# EAGLE design tcxo_breakout (EAGLE 9.2.2)
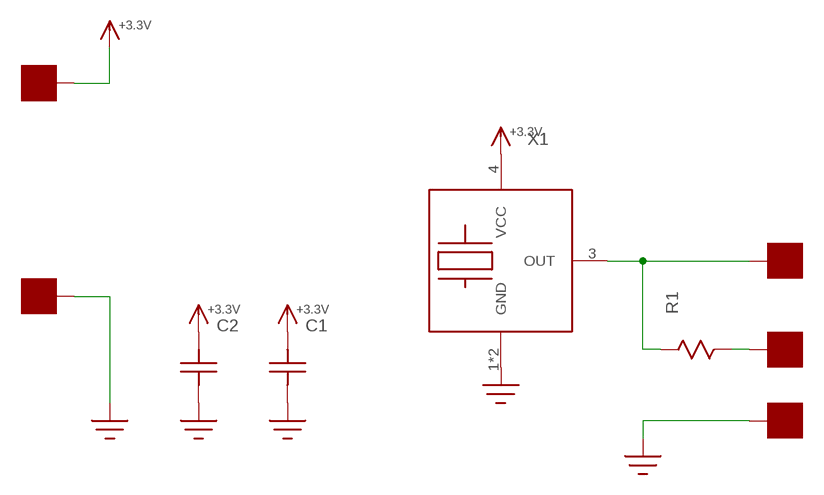
[diagram p0: schematic, sheet 1]

## Parts
C1  C0603  [C0603]
C2  C0805  [0805]
R1  R0603  [R0603]
U$1  PAD100MIL  [PAD_100MIL]
U$2  PAD100MIL  [PAD_100MIL]
U$3  PAD100MIL  [PAD_100MIL]
U$12  PAD100MIL  [PAD_100MIL]
U$13  PAD100MIL  [PAD_100MIL]
X1  XTAL_OSC3.2X2.5  [XTAL_3.2X2.5]

## Nets
+3.3V: C1.P$2 C2.P$2 U$1.P$1 X1.4(VCC)
GND: C1.P$1 C2.P$1 U$2.P$1 U$13.P$1 X1.1(GND) X1.2(GND)
N$1: R1.P$1 U$3.P$1 X1.3(OUT)
N$2: R1.P$2 U$12.P$1

## Library data of the parts
C1 C2 = yapo:C
R1 = yapo:R
U$1-U$3 U$12 U$13 = yapo:PAD
X1 = yapo:XTAL_OSC

## Board
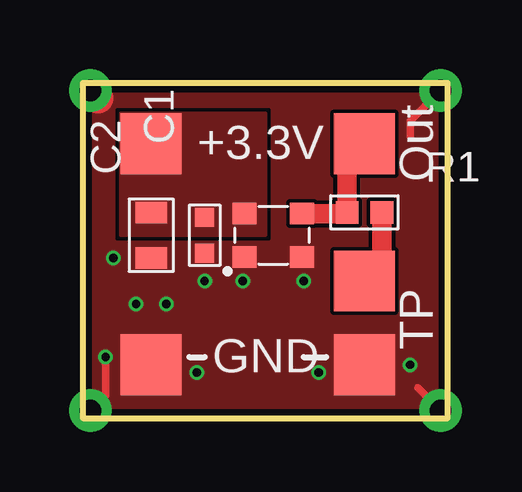
[diagram p1: board, top side]
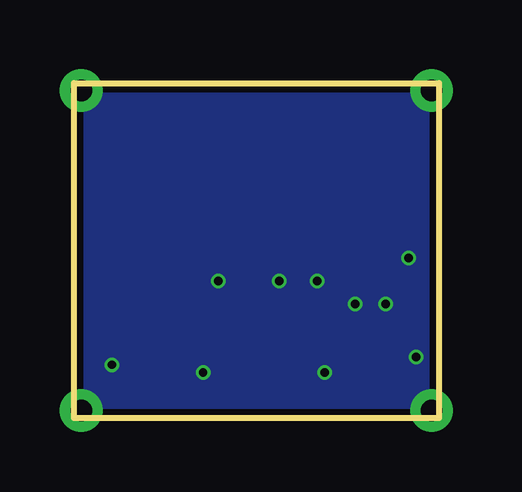
[diagram p2: board, bottom side, seen from below]

Size 15.22 x 13.96 mm. Coordinates in mm from the lower left corner, seen from the top.
Outline: 0,0 15.22,0 15.22,13.96 0,13.96 0,0
Copper layers (1*16): Top 0.035559375mm / dielectric 1.6mm / Bottom 0.035559375mm
Design rules "oshpark-2layer *": minimum track width 6mil, minimum drill 10mil, track to track 6mil, track to pad 6mil, pad to pad 6mil, via to via 6mil, smd to smd 6mil, copper to edge 10mil, drill to drill 6mil, minimum pad ring 5mil, minimum via ring 5mil, stop-mask expansion 2.5mil, vias tented up to drill 0mil, thermal gap 10mil

### Footprints (pad centres in the part's own frame; a part is rotated, then mirrored left to right if it is on the bottom)
C0603 = smd 0.8 x 0.8: P$1 -0.75,0; P$2 0.75,0
0805 = smd 0.9 x 1.3: P$1 -0.95,0; P$2 0.95,0
R0603 = smd 0.95 x 0.95: P$1 -0.725,0; P$2 0.725,0
PAD_100MIL = smd 2.54 x 2.54: P$1 0,0
XTAL_3.2X2.5 = smd 1 x 0.9: 1 -1.2,-0.9; 2 1.2,-0.9; 3 1.2,0.9; 4 -1.2,0.9

### Placement (x,y rotation side)
C1  5.08,7.62 90 top
C2  2.86,7.62 90 top
R1  11.75,8.57 0 top
U$1  2.86,11.43 0 top
U$2  2.86,2.22 0 top
U$3  11.75,11.43 0 top
U$12  11.75,5.71 0 top
U$13  11.75,2.22 0 top
X1  7.94,7.62 0 top

### Tracks (layer width: path | path; a pad name or v marks a point on that pad's centre or on a via)
+3.3V
  pour Top (no thermals): 1.59,12.7 1.59,7.62 7.62,7.62 7.62,12.7
GND  (via drill 0.35, 0.9 pad 1.78)
  Top 0.305: v0.32,0.32 0.95,0.95 v0.95,2.54 | v14.92,13.65 13.65,12.38 13.65,11.75 | v14.92,0.32 13.97,1.27
  Top 1.27: v0.32,13.65 0.64,13.34
  other vias: 1.27,6.67 5.08,5.71 6.67,5.71 9.21,5.71 2.22,4.76 4.76,1.91 3.49,4.76 9.84,1.91 13.65,2.22
  pour Top (rank 2, no thermals): 0,13.97 15.24,13.97 15.24,0 0,0
  pour Bottom: 0,13.97 15.24,13.97 15.24,0 0,0
N$1
  Top 0.813: X1.3 10.97,8.52 R1.P$1 11.02,10.71 U$3.P$1
N$2
  Top 0.813: R1.P$2 12.47,6.44 U$12.P$1

### Text on the board
tPlace: +3.3V | Out | TP | GND